# EasyEDA schematic Shield_Amir_Shalev_V_0_0.json
TITLE: For Shalev (Polar and cartezian exhibit, 3D exhebition); REV: 1.0; Date: 2023-07-23; Sheet: 1/1; Company: Amir BS
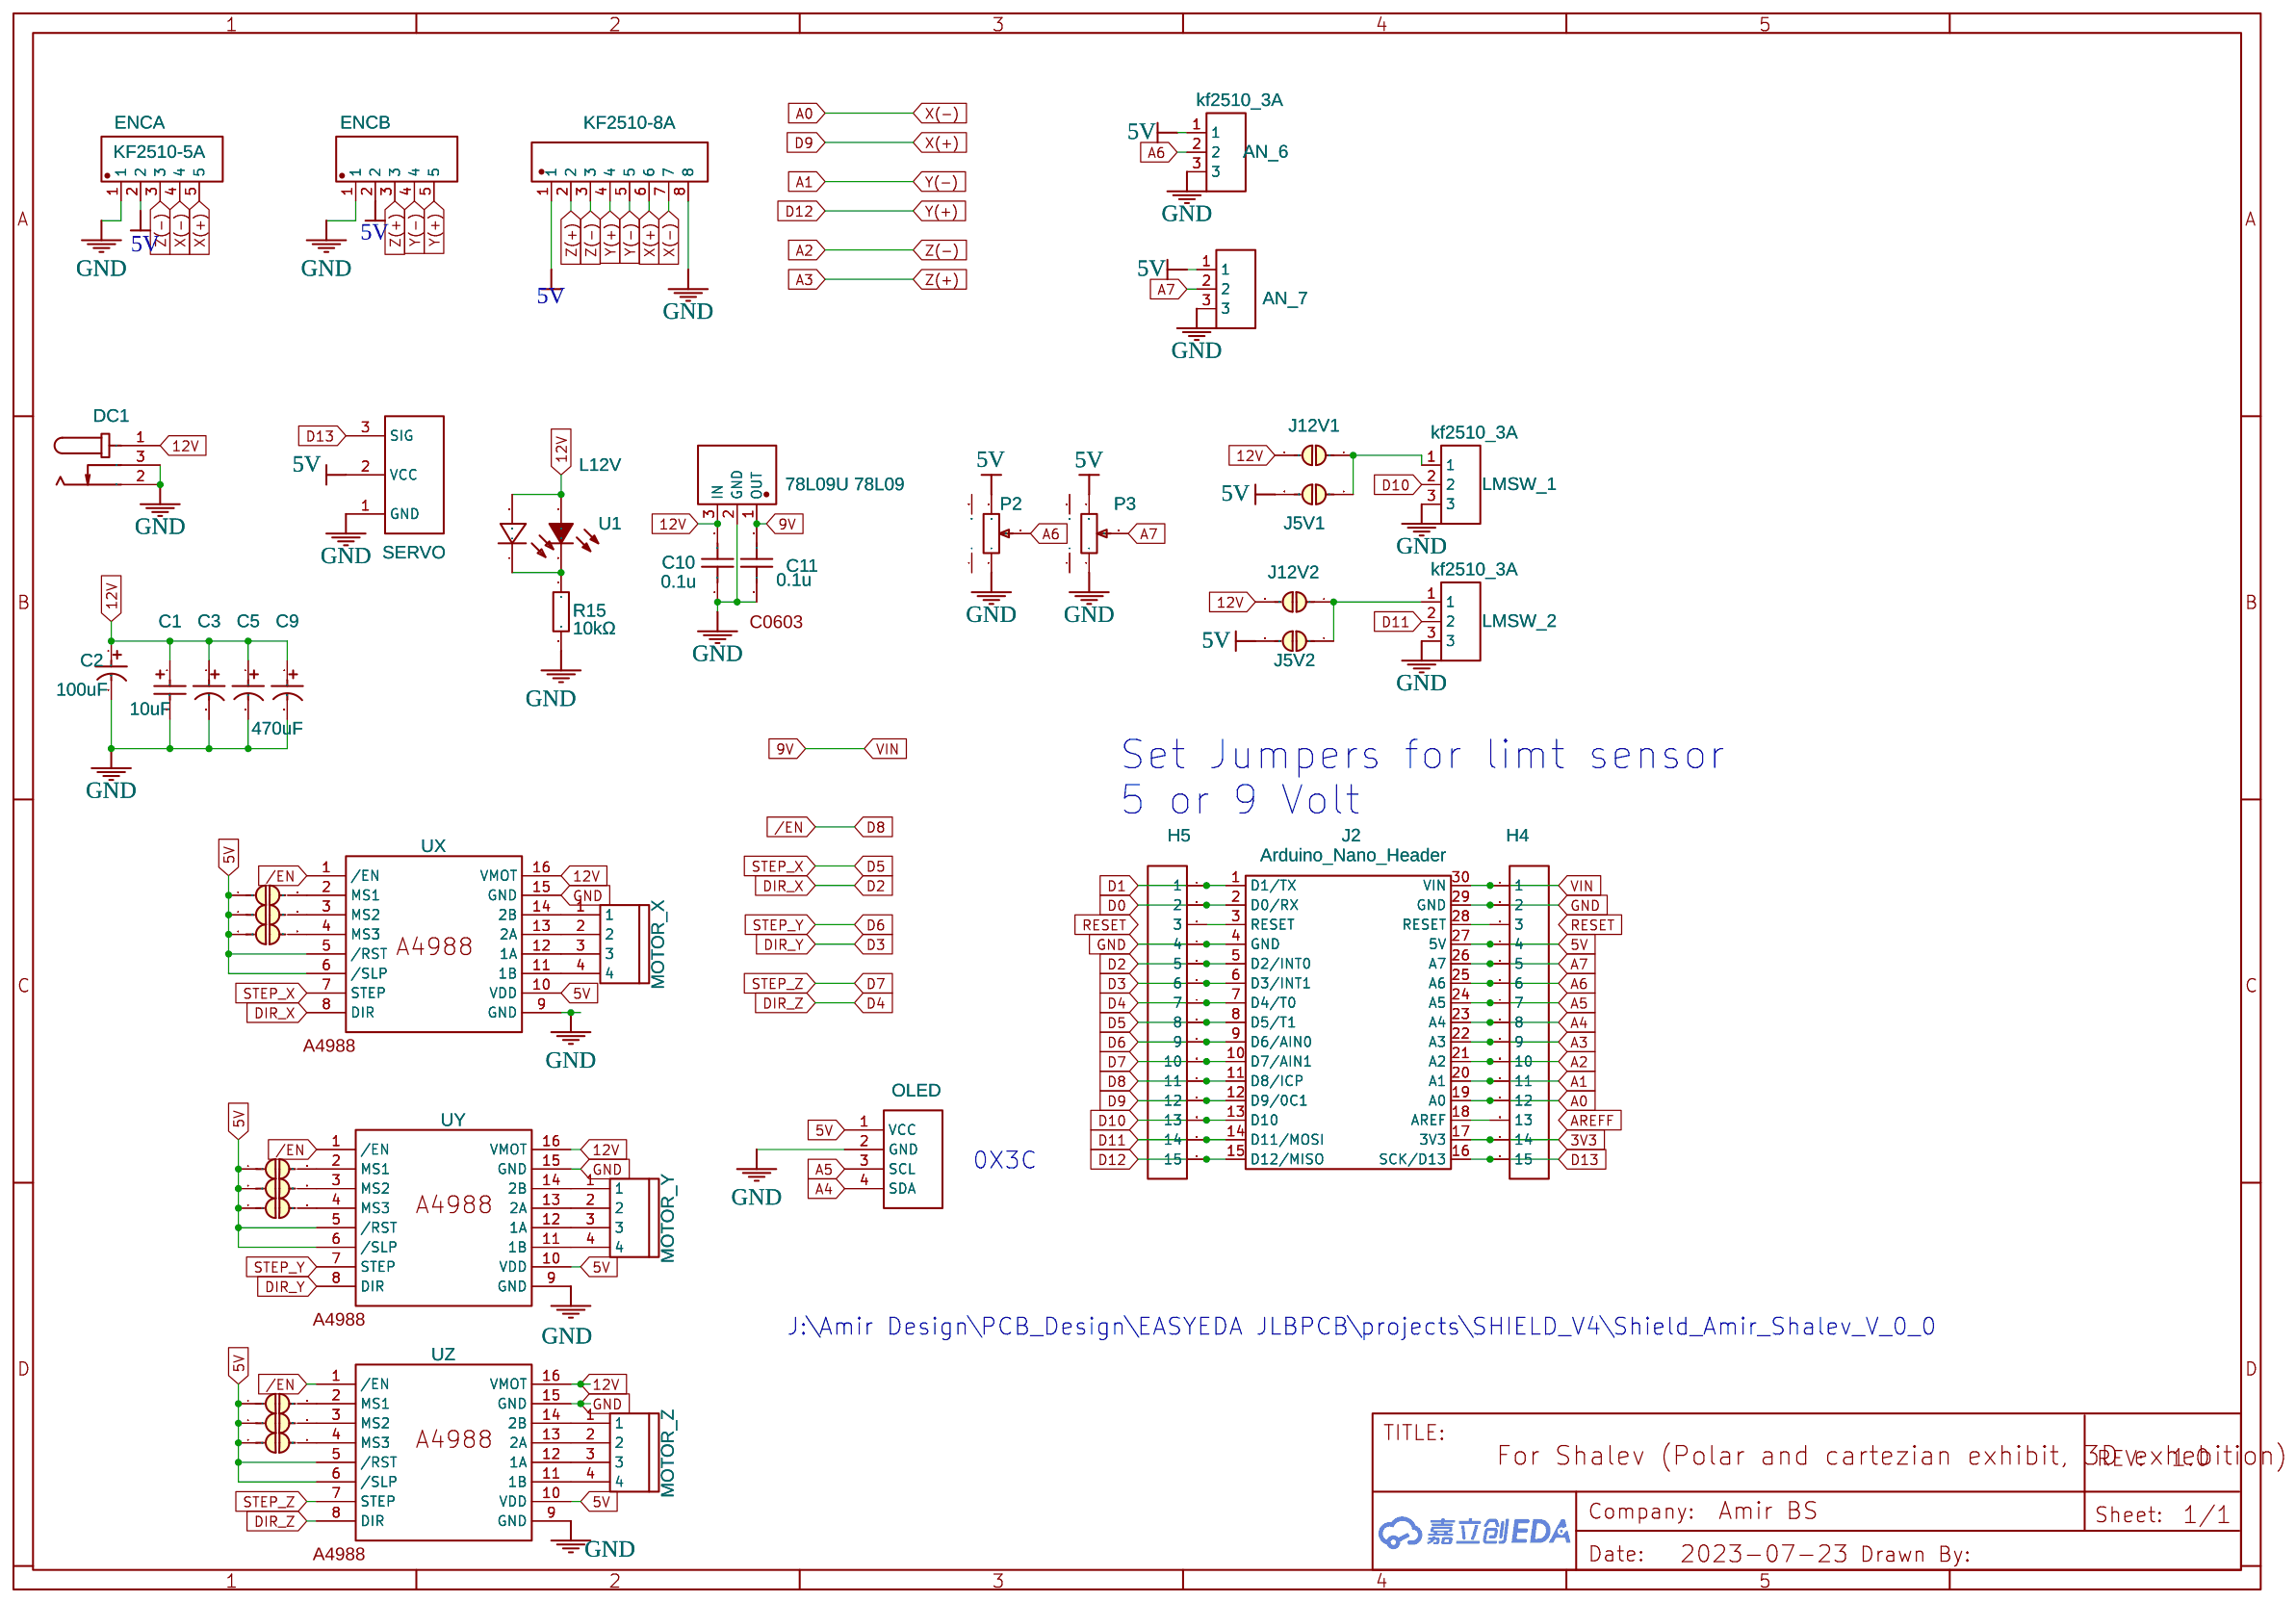
[diagram p0: schematic sheet]

## Parts
AN_6  kf2510_3A  [CONN-TH_3P-P2.00_KF2510_3A]
AN_7  kf2510_3A  [CONN-TH_3P-P2.00_KF2510_3A]
C1  10uF  [CAP-SMD_L3.2-W1.6-RD-C7171]
C2  100uF  [CAP-TH_BD6.3-P2.50-D1.0-FD]
C3  470uF  [CAP-TH_BD8.0-P3.50-D0.6-FD]
C5  470uF  [CAP-TH_BD8.0-P3.50-D0.6-FD]
C9  470uF  [CAP-TH_BD8.0-P3.50-D0.6-FD]
C10  0.1u  [C0603]
C11  0.1u  [C0603]
CN2  KF2510-8A  [CONN-TH_8P-P2.54_KF2510-8A]
DC1  DC  [DC-IN-TH_DC005]
ENCA  KF2510-5A  [CONN-TH_5P-P2.54_KF2510-5A]
ENCB  KF2510-5A  [CONN-TH_5P-P2.54_KF2510-5A]
H4  HDR-F-2.54_1x15  [HDR-F-2.54_1X15]
H5  HDR-F-2.54_1x15  [HDR-F-2.54_1X15]
J2  Arduino_Nano_Header  [DIP-30_L43.18-W15.24-ARDUINONANO]
J5V1  JUMPER-SMT_2  [JUMPERS_SMT-JUMPER_2_NC_PASTE_NO-SILK]
J5V2  JUMPER-SMT_2  [JUMPERS_SMT-JUMPER_2_NC_PASTE_NO-SILK]
J12V1  JUMPER-SMT_2  [JUMPERS_SMT-JUMPER_2_NC_PASTE_NO-SILK]
J12V2  JUMPER-SMT_2  [JUMPERS_SMT-JUMPER_2_NC_PASTE_NO-SILK]
JX1  JUMPER-SMT_2  [JUMPERS_SMT-JUMPER_2_NC_PASTE_NO-SILK]
JX2  JUMPER-SMT_2  [JUMPERS_SMT-JUMPER_2_NC_PASTE_NO-SILK]
JX3  JUMPER-SMT_2  [JUMPERS_SMT-JUMPER_2_NC_PASTE_NO-SILK]
JY1  JUMPER-SMT_2  [JUMPERS_SMT-JUMPER_2_NC_PASTE_NO-SILK]
JY2  JUMPER-SMT_2  [JUMPERS_SMT-JUMPER_2_NC_PASTE_NO-SILK]
JY3  JUMPER-SMT_2  [JUMPERS_SMT-JUMPER_2_NC_PASTE_NO-SILK]
JZ1  JUMPER-SMT_2  [JUMPERS_SMT-JUMPER_2_NC_PASTE_NO-SILK]
JZ2  JUMPER-SMT_2  [JUMPERS_SMT-JUMPER_2_NC_PASTE_NO-SILK]
JZ3  JUMPER-SMT_2  [JUMPERS_SMT-JUMPER_2_NC_PASTE_NO-SILK]
L12V  LED  [LED0603-R-RD_BLUE]
LMSW_1  kf2510_3A  [CONN-TH_3P-P2.00_KF2510_3A]
LMSW_2  kf2510_3A  [CONN-TH_3P-P2.00_KF2510_3A]
MOTOR_X  XH2.54-4AW  [CONN-TH_XH2.54-4AW]
MOTOR_Y  XH2.54-4AW  [CONN-TH_XH2.54-4AW]
MOTOR_Z  XH2.54-4AW  [CONN-TH_XH2.54-4AW]
OLED  1.3 inch OLED SSH1106 I2C 128x64 copy  [1.3_OLED_SSH1106_I2C_128X64_BOARD]
P2  长柄旋转电位器  [RES-ADJ-TH_RV09]
P3  长柄旋转电位器  [RES-ADJ-TH_RV09]
R15  10kΩ  [R0603]
SERVO  Servo+3d  [SERVO+3D]
U1  LED-DIP-3MM_RED  [LED-TH_BD4.1-P2.00-D0.5-RD_RED]
U5  78L09U 78L09  [SOT-89-3_L4.5-W2.5-P1.50-LS4.0-BR]
UX  A4988  [A4988]
UY  A4988  [A4988]
UZ  A4988  [A4988]

## Library data of the parts
AN_6 AN_7 LMSW_1 LMSW_2 = kf2510_3A: JLCPCB Part Class: Extended Part; Package Display: No
C1 = TAJA106K016RNJ: Supplier: LCSC; Manufacturer: Kyocera AVX; Supplier Part: C7171; JLCPCB Part Class: Basic Part; Package Display: No
C2 = 100uF 35V 6.3*11: Supplier: LCSC; Manufacturer: CX(承兴); Supplier Part: C19504; JLCPCB Part Class: Extended Part; Package Display: No
C3 C5 C9 = 470uF 25V 8*12Black high frequency: Supplier: LCSC; Manufacturer: CX(承兴); Supplier Part: C44602; JLCPCB Part Class: Extended Part; Package Display: No
C10 = C_0603_US: Contributor: LCEDA_Lib; Package Display: No
C11 = C_0603_US: Contributor: LCEDA_Lib; Package Display: Yes
CN2 = KF2510-8A: Contributor: LCSC; Supplier: LCSC; Supplier Part: C503487; Manufacturer: BOOMELE(博穆精密); JLCPCB Part Class: Extended Part; Package Display: No
DC1 = DC005-2.0MM: Supplier: LCSC; Manufacturer: SOFNG; Supplier Part: C111567; Package Display: No
ENCA ENCB = KF2510-5A: JLCPCB Part Class: Extended Part; Package Display: No
H4 H5 = HDR-F-2.54_1x15: Supplier Part: C124408; Supplier: LCSC; Contributor: LCEDA_Lib; Package Display: No
J2 = Arduino_Nano_Header
J5V1 J5V2 J12V1 J12V2 JX1-JX3 JY1-JY3 JZ1-JZ3 = JUMPER-SMT_2: Contributor: P-Thomsen; Package Display: No
L12V = 19-217/BHC-ZL1M2RY/3T: Supplier: LCSC; Manufacturer: EVERLIGHT; Supplier Part: C72041; JLCPCB Part Class: Basic Part; Package Display: No
MOTOR_X MOTOR_Y MOTOR_Z = XH2.54-4AW: JLCPCB Part Class: Extended Part; Package Display: No
OLED = 1.3 inch OLED SSH1106 I2C 128x64 copy: Contributor: Deguello; Package Display: No
P2 P3 = 长柄旋转电位器: Supplier: LCSC; Supplier Part: C2874842; Manufacturer: null; JLCPCB Part Class: Extended Part; Contributor: LCSC; Package Display: No
R15 = 0603WAF1002T5E: Supplier: LCSC; Manufacturer: UNI-ROYAL(厚声); Supplier Part: C25804; Resistance (Ohms): 10K; JLCPCB Part Class: Basic Part; Package Display: No
SERVO = Servo+3d: Manufacturer Part: New SchematicLib; Contributor: pjsg; Package Display: No
U1 = LED-DIP-3MM_RED: Contributor: LCSC; Supplier: LCSC; Supplier Part: C9900002364; Manufacturer: null; JLCPCB Part Class: Extended Part; Package Display: No
U5 = 78L09U 78L09: Contributor: LCSC; Supplier: LCSC; Supplier Part: C2875177; Manufacturer: CBI(创基); JLCPCB Part Class: Extended Part; Package Display: No
UX UY UZ = A4988: Contributor: unaja_closp; Package Display: Yes

## Nets
3V3: H4.14 J2.17(3V3)
5V: AN_6.1 AN_7.1 CN2.1 ENCA.2 ENCB.2 H4.4 J2.27(5V) J5V1.2 J5V2.2 JX1.1 JX2.1 JX3.1 JY1.1 JY2.1 JY3.1 JZ1.1 JZ2.1 JZ3.1 OLED.1(VCC) P2.3 P3.3 SERVO.2(VCC) UX.5(/RST) UX.6(/SLP) UX.10(VDD) UY.5(/RST) UY.6(/SLP) UY.10(VDD) UZ.5(/RST) UZ.6(/SLP) UZ.10(VDD)
9V: C11.2 H4.1 J2.30(VIN) U5.1(OUT)
12V: C1.1 C2.1 C3.1 C5.1 C9.1 C10.2 DC1.1 J12V1.2 J12V2.2 L12V.1(A) U1.2 U5.3(IN) UX.16(VMOT) UY.16(VMOT) UZ.16(VMOT)
GND: AN_6.3 AN_7.3 C1.2 C2.2 C3.2 C5.2 C9.2 C10.1 C11.1 CN2.8 DC1.2 DC1.3 ENCA.1 ENCB.1 H4.2 H5.4 J2.4(GND) J2.29(GND) LMSW_1.3 LMSW_2.3 OLED.2(GND) P2.1 P3.1 R15.2 SERVO.1(GND) U5.2(GND) UX.9(GND) UX.15(GND) UY.9(GND) UY.15(GND) UZ.9(GND) UZ.15(GND)
/EN: H5.11 J2.11(D8/ICP) UX.1(/EN) UY.1(/EN) UZ.1(/EN)
A0: CN2.7 ENCA.4 H4.12 J2.19(A0)
A1: CN2.5 ENCB.4 H4.11 J2.20(A1)
A2: CN2.3 ENCA.3 H4.10 J2.21(A2)
A3: CN2.2 ENCB.3 H4.9 J2.22(A3)
A4: H4.8 J2.23(A4) OLED.4(SDA)
A5: H4.7 J2.24(A5) OLED.3(SCL)
A6: AN_6.2 H4.6 J2.25(A6) P2.2
A7: AN_7.2 H4.5 J2.26(A7) P3.2
D0: H5.2 J2.2(D0/RX)
D1: H5.1 J2.1(D1/TX)
D2: H5.5 J2.5(D2/INT0) UX.8(DIR)
D3: H5.6 J2.6(D3/INT1) UY.8(DIR)
D4: H5.7 J2.7(D4/T0) UZ.8(DIR)
D5: H5.8 J2.8(D5/T1) UX.7(STEP)
D6: H5.9 J2.9(D6/AIN0) UY.7(STEP)
D7: H5.10 J2.10(D7/AIN1) UZ.7(STEP)
D9: CN2.6 ENCA.5 H5.12 J2.12(D9/0C1)
D10: H5.13 J2.13(D10) LMSW_1.2
D11: H5.14 J2.14(D11/MOSI) LMSW_2.2
D12: CN2.4 ENCB.5 H5.15 J2.15(D12/MISO)
D13: H4.15 J2.16(SCK/D13) SERVO.3(SIG)
Net-(H4-3): H4.3 J2.28(RESET)
Net-(H4-13): H4.13 J2.18(AREF)
Net-(H5-3): H5.3 J2.3(RESET)
Net-(J5V1-1): J5V1.1 J12V1.1 LMSW_1.1
Net-(J5V2-1): J5V2.1 J12V2.1 LMSW_2.1
Net-(JX1-2): JX1.2 UX.2(MS1)
Net-(JX2-2): JX2.2 UX.3(MS2)
Net-(JX3-2): JX3.2 UX.4(MS3)
Net-(JY1-2): JY1.2 UY.2(MS1)
Net-(JY2-2): JY2.2 UY.3(MS2)
Net-(JY3-2): JY3.2 UY.4(MS3)
Net-(JZ1-2): JZ1.2 UZ.2(MS1)
Net-(JZ2-2): JZ2.2 UZ.3(MS2)
Net-(JZ3-2): JZ3.2 UZ.4(MS3)
Net-(L12V-2): L12V.2(C) R15.1 U1.1
Net-(MOTOR_X-1): MOTOR_X.1 UX.14(2B)
Net-(MOTOR_X-2): MOTOR_X.2 UX.13(2A)
Net-(MOTOR_X-3): MOTOR_X.3 UX.12(1A)
Net-(MOTOR_X-4): MOTOR_X.4 UX.11(1B)
Net-(MOTOR_Y-1): MOTOR_Y.1 UY.14(2B)
Net-(MOTOR_Y-2): MOTOR_Y.2 UY.13(2A)
Net-(MOTOR_Y-3): MOTOR_Y.3 UY.12(1A)
Net-(MOTOR_Y-4): MOTOR_Y.4 UY.11(1B)
Net-(MOTOR_Z-1): MOTOR_Z.1 UZ.14(2B)
Net-(MOTOR_Z-2): MOTOR_Z.2 UZ.13(2A)
Net-(MOTOR_Z-3): MOTOR_Z.3 UZ.12(1A)
Net-(MOTOR_Z-4): MOTOR_Z.4 UZ.11(1B)

Not connected (* = marked no-connect by the designer): P2 4 5; P3 4 5

## Notes on the sheet
- Set Jumpers for limt sensor
  5 or 9 Volt
- 0X3C
- J:\Amir Design\PCB_Design\EASYEDA JLBPCB\projects\SHIELD_V4\Shield_Amir_Shalev_V_0_0
